# EAGLE design bbaudio (EAGLE 6.4)
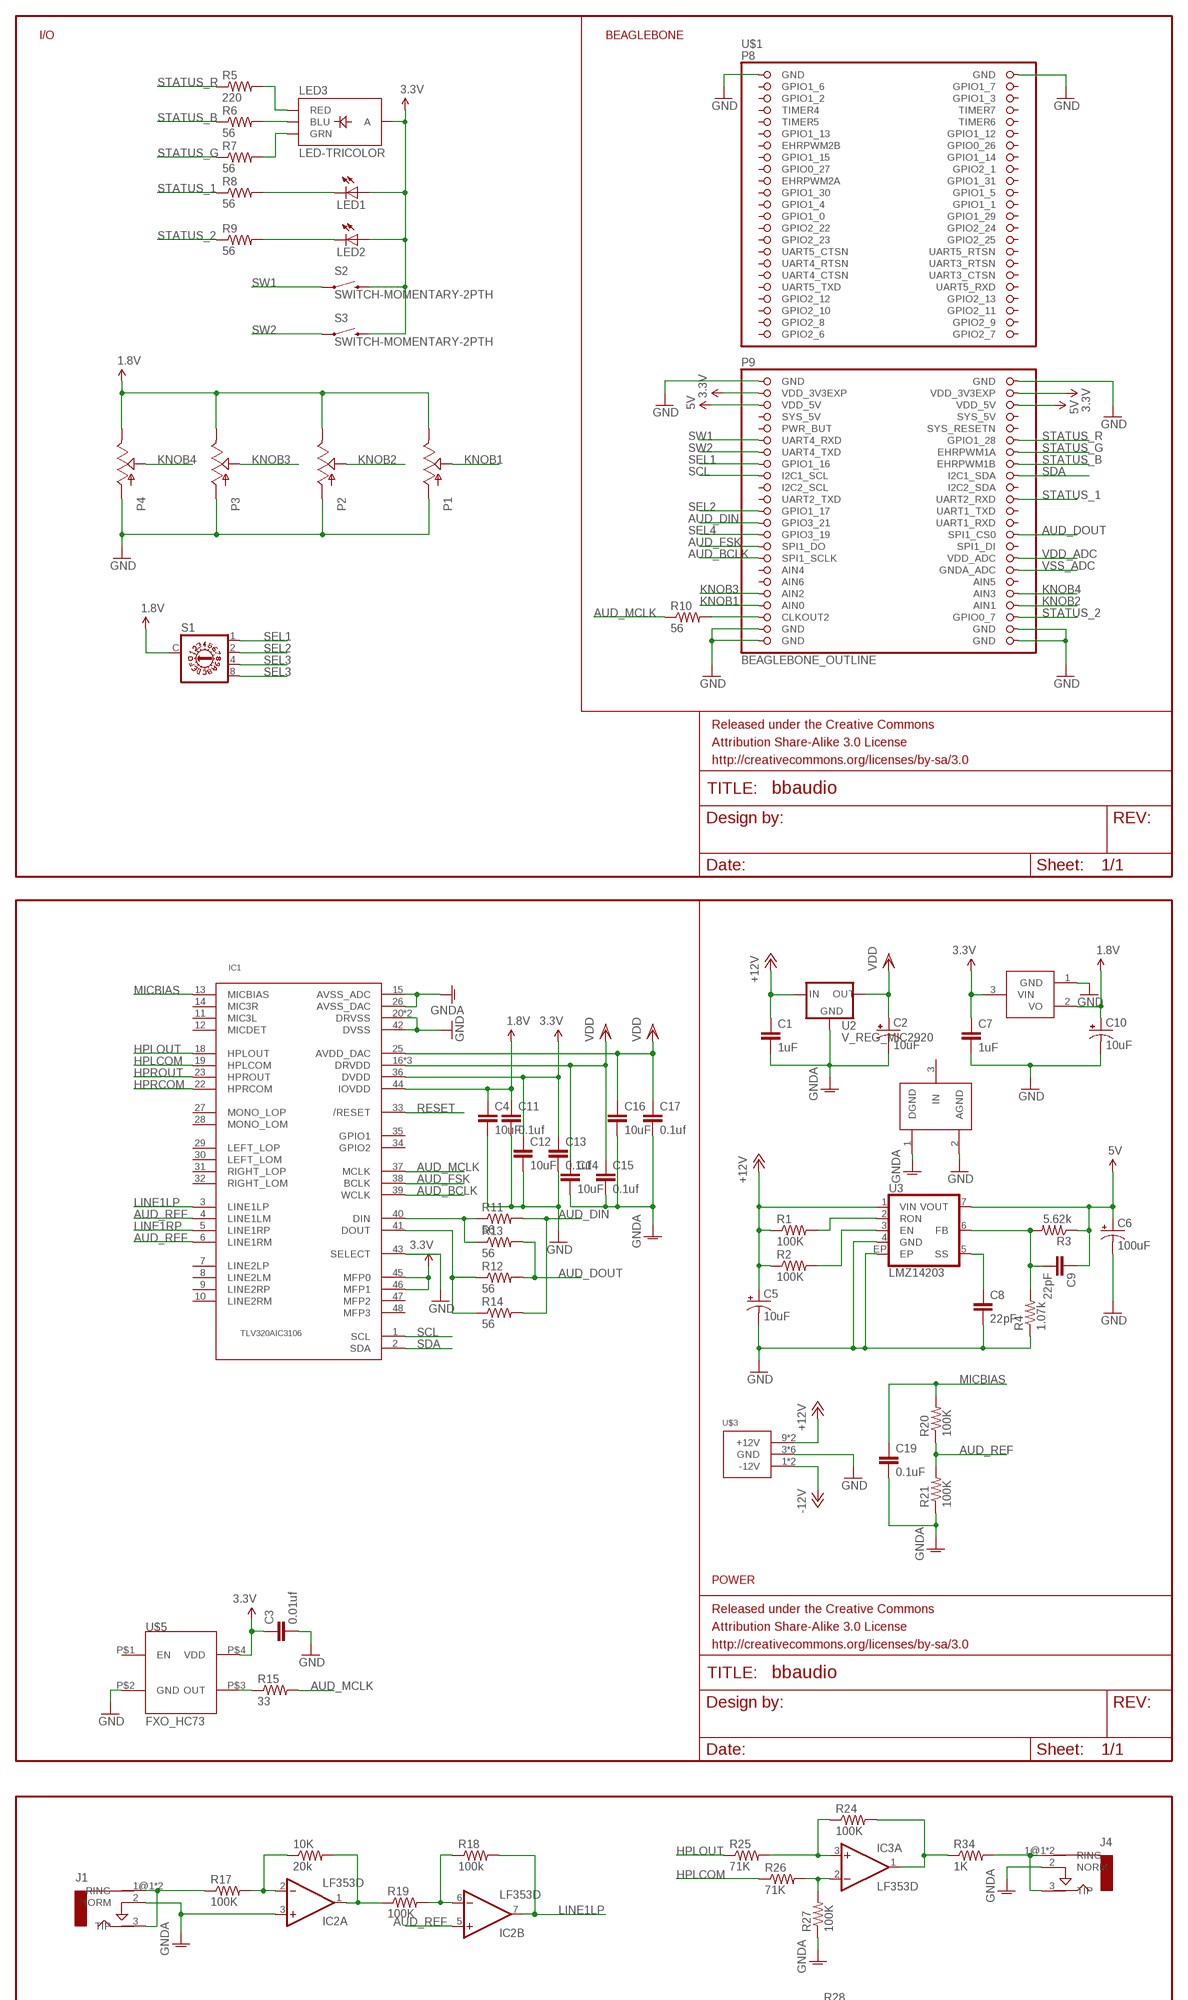
[diagram p0: schematic, sheet 1, part 1 of 2]
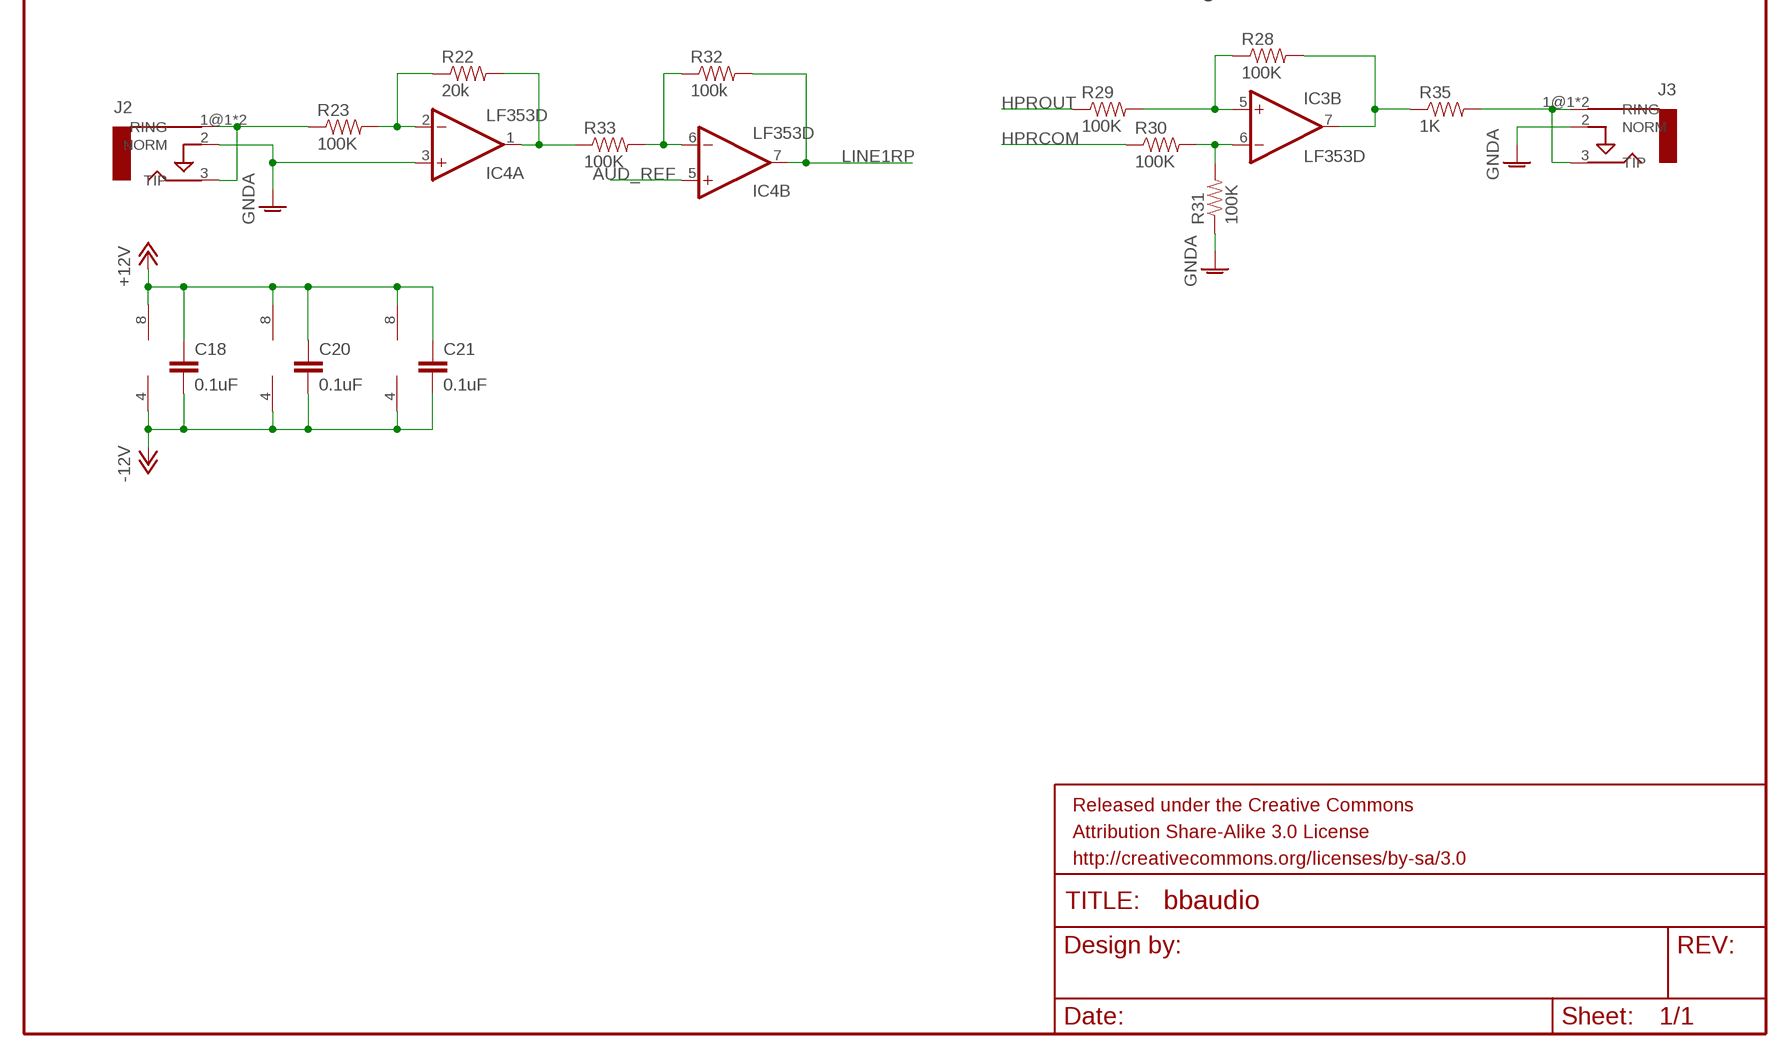
[diagram p1: schematic, sheet 1, part 2 of 2]

## Parts
10K  20k  RESISTOR0603-RES  [0603-RES]
C1  1uF  C-EUC0603  [C0603]
C2  10uF  CAP_POL1206  [EIA3216]
C3  0.01uf  C-EUC0603  [C0603]
C4  10uF  C-EUC0603  [C0603]
C5  10uF  CAP_POL1206  [EIA3216]
C6  100uF  CAP_POL1206  [EIA3216]
C7  1uF  C-EUC0603  [C0603]
C8  22pF  C-EUC0603  [C0603]
C9  22pF  C-EUC0603  [C0603]
C10  10uF  CAP_POL1206  [EIA3216]
C11  0.1uf  C-EUC0603  [C0603]
C12  10uF  C-EUC0603  [C0603]
C13  0.1uf  C-EUC0603  [C0603]
C14  10uF  C-EUC0603  [C0603]
C15  0.1uf  C-EUC0603  [C0603]
C16  10uF  C-EUC0603  [C0603]
C17  0.1uf  C-EUC0603  [C0603]
C18  0.1uF  C-EUC0603  [C0603]
C19  0.1uF  C-EUC0603  [C0603]
C20  0.1uF  C-EUC0603  [C0603]
C21  0.1uF  C-EUC0603  [C0603]
IC1  TLV320AIC3106  [QFN48]
IC2  LF353D  [SO08]
IC3  LF353D  [SO08]
IC4  LF353D  [SO08]
J1  AUDIO-JACKERTHENVAR  [ERTHENVAR-JACK]
J2  AUDIO-JACKERTHENVAR  [ERTHENVAR-JACK]
J3  AUDIO-JACKERTHENVAR  [ERTHENVAR-JACK]
J4  AUDIO-JACKERTHENVAR  [ERTHENVAR-JACK]
LED1  LED-FKIT-1206  [FKIT-LED-1206]
LED2  LED-FKIT-1206  [FKIT-LED-1206]
LED3  LED-TRICOLOR  [LED-TRICOLOR-SMD]
P1  SPARKFUN_POTPDB12  [SPARKFUN_PDB12]
P2  SPARKFUN_POTPDB12  [SPARKFUN_PDB12]
P3  SPARKFUN_POTPDB12  [SPARKFUN_PDB12]
P4  SPARKFUN_POTPDB12  [SPARKFUN_PDB12]
R1  100K  RESISTOR0603-RES  [0603-RES]
R2  100K  RESISTOR0603-RES  [0603-RES]
R3  5.62k  RESISTOR0603-RES  [0603-RES]
R4  1.07k  RESISTOR0603-RES  [0603-RES]
R5  220  RESISTOR0603-RES  [0603-RES]
R6  56  RESISTOR0603-RES  [0603-RES]
R7  56  RESISTOR0603-RES  [0603-RES]
R8  56  RESISTOR0603-RES  [0603-RES]
R9  56  RESISTOR0603-RES  [0603-RES]
R10  56  RESISTOR0603-RES  [0603-RES]
R11  56  RESISTOR0603-RES  [0603-RES]
R12  56  RESISTOR0603-RES  [0603-RES]
R13  56  RESISTOR0603-RES  [0603-RES]
R14  56  RESISTOR0603-RES  [0603-RES]
R15  33  RESISTOR0603-RES  [0603-RES]
R17  100K  RESISTOR0603-RES  [0603-RES]
R18  100k  RESISTOR0603-RES  [0603-RES]
R19  100K  RESISTOR0603-RES  [0603-RES]
R20  100K  RESISTOR0603-RES  [0603-RES]
R21  100K  RESISTOR0603-RES  [0603-RES]
R22  20k  RESISTOR0603-RES  [0603-RES]
R23  100K  RESISTOR0603-RES  [0603-RES]
R24  100K  RESISTOR0603-RES  [0603-RES]
R25  71K  RESISTOR0603-RES  [0603-RES]
R26  71K  RESISTOR0603-RES  [0603-RES]
R27  100K  RESISTOR0603-RES  [0603-RES]
R28  100K  RESISTOR0603-RES  [0603-RES]
R29  100K  RESISTOR0603-RES  [0603-RES]
R30  100K  RESISTOR0603-RES  [0603-RES]
R31  100K  RESISTOR0603-RES  [0603-RES]
R32  100k  RESISTOR0603-RES  [0603-RES]
R33  100K  RESISTOR0603-RES  [0603-RES]
R34  1K  RESISTOR0603-RES  [0603-RES]
R35  1K  RESISTOR0603-RES  [0603-RES]
S1  P103  [P103]
S2  SWITCH-MOMENTARY-2PTH  [TACTILE-PTH]
S3  SWITCH-MOMENTARY-2PTH  [TACTILE-PTH]
U2  V_REG_MIC2920  [SOT223]
U3  LMZ14203  [TO-PMOD-7]
U4  VREG  [SOT23-3]
U$1  BEAGLEBONE_OUTLINE  [BEAGLEBONE_SHIELD]
U$3  POWER_SIMPLE10  [POWER_10]
U$5  FXO_HC73  [4PIN]
U$11  GND_CONNECT  [GND_CONNECT]

## Nets
1.8V: C4.1 C10.A(+) C11.1 IC1.44(IOVDD) P1.3(E) P2.3(E) P3.3(E) P4.3(E) S1.C U4.2(VO)
3.3V: C3.1 C7.1 C12.1 C13.1 IC1.36(DVDD) IC1.45(MFP0) IC1.46(MFP1) LED1.A LED2.A LED3.A S2.3 S3.3 U4.3(VIN) U$1.49(VDD_3V3EXP) U$1.50(VDD_3V3EXP) U$5.P$4(VDD)
5V: C6.A(+) C9.1 R3.1 U3.7(VOUT) U$1.51(VDD_5V) U$1.52(VDD_5V)
+12V: C1.1 C5.A(+) C18.1 C20.1 C21.1 IC2.8(P:V+) IC3.8(P:V+) IC4.8(P:V+) R1.1 R2.1 U2.1(IN) U3.1(VIN) U$3.9(+12V) U$3.10(+12V)
-12V: C18.2 C20.2 C21.2 IC2.4(P:V-) IC3.4(P:V-) IC4.4(P:V-) U$3.1(-12V) U$3.2(-12V)
AUD_BCLK: IC1.39(WCLK) U$1.77(SPI1_SCLK)
AUD_DIN: R11.2 R14.2 U$1.71(GPIO3_21)
AUD_DOUT: R12.2 R13.2 U$1.74(SPI1_CS0)
AUD_FSK: IC1.38(BCLK) U$1.75(SPI1_DO)
AUD_MCLK: IC1.37(MCLK) R10.1 R15.2
AUD_REF: IC1.4(LINE1LM) IC1.6(LINE1RM) IC2.5(B:+IN) IC4.5(B:+IN) R20.1 R21.2
GND: C3.2 C4.2 C5.C(-) C6.C(-) C7.2 C8.2 C10.C(-) C11.2 C12.2 C13.2 IC1.20(DRVSS) IC1.21(DRVSS) IC1.42(DVSS) IC1.43(SELECT) P1.1(A) P2.1(A) P3.1(A) P4.1(A) R4.1 U3.4(GND) U3.EP U4.1(GND) U$1.1(GND) U$1.2(GND) U$1.47(GND) U$1.48(GND) U$1.89(GND) U$1.90(GND) U$1.91(GND) U$1.92(GND) U$3.3(GND) U$3.4(GND) U$3.5(GND) U$3.6(GND) U$3.7(GND) U$3.8(GND) U$5.P$2(GND) U$11.2(AGND)
GNDA: C1.2 C2.C(-) C14.2 C15.2 C16.2 C17.2 C19.2 IC1.15(AVSS_ADC) IC1.26(AVSS_DAC) IC2.3(A:+IN) IC4.3(A:+IN) J1.2(NORM) J2.2(NORM) J3.2(NORM) J4.2(NORM) R21.1 R27.1 R31.1 U2.2(GND) U$11.1(DGND)
HPLCOM: IC1.19(HPLCOM) R26.1
HPLOUT: IC1.18(HPLOUT) R25.1
HPRCOM: IC1.22(HPRCOM) R30.1
HPROUT: IC1.23(HPROUT) R29.1
KNOB1: P1.2(S) U$1.85(AIN0)
KNOB2: P2.2(S) U$1.86(AIN1)
KNOB3: P3.2(S) U$1.83(AIN2)
KNOB4: P4.2(S) U$1.84(AIN3)
LINE1LP: IC1.3(LINE1LP) IC2.7(B:OUT) R18.2
LINE1RP: IC1.5(LINE1RP) IC4.7(B:OUT) R32.2
MICBIAS: C19.1 IC1.13(MICBIAS) R20.2
N$1: LED3.R(RED) R5.2
N$2: LED3.B(BLU) R6.2
N$3: LED3.G(GRN) R7.2
N$4: LED1.C R8.2
N$5: LED2.C R9.2
N$6: R1.2 U3.2(RON)
N$7: R2.2 U3.3(EN)
N$8: C8.1 U3.5(SS)
N$9: R10.2 U$1.87(CLKOUT2)
N$10: IC1.40(DIN) R11.1 R13.1
N$11: IC1.41(DOUT) R12.1 R14.1
N$12: R15.1 U$5.P$3(OUT)
N$13: C9.2 R3.2 R4.2 U3.6(FB)
N$14: 10K.2 IC2.1(A:OUT) R19.1
N$15: IC2.6(B:-IN) R18.1 R19.2
N$17: 10K.1 IC2.2(A:-IN) R17.2
N$18: J1.1@1(RING) J1.1@2(RING) J1.3(TIP) R17.1
N$19: J2.1@1(RING) J2.1@2(RING) J2.3(TIP) R23.1
N$20: J4.1@1(RING) J4.1@2(RING) J4.3(TIP) R34.2
N$21: IC4.2(A:-IN) R22.1 R23.2
N$22: IC4.1(A:OUT) R22.2 R33.1
N$23: IC4.6(B:-IN) R32.1 R33.2
N$27: IC3.1(A:OUT) R24.2 R34.1
N$28: IC3.3(A:+IN) R24.1 R25.2
N$29: IC3.2(A:-IN) R26.2 R27.2
N$31: IC3.7(B:OUT) R28.2 R35.1
N$32: IC3.5(B:+IN) R28.1 R29.2
N$33: IC3.6(B:-IN) R30.2 R31.2
N$34: J3.1@1(RING) J3.1@2(RING) J3.3(TIP) R35.2
RESET: IC1.33(/RESET)
SCL: IC1.1(SCL) U$1.63(I2C1_SCL)
SDA: IC1.2(SDA) U$1.64(I2C1_SDA)
SEL1: S1.1 U$1.61(GPIO1_16)
SEL2: S1.2 U$1.69(GPIO1_17)
SEL3: S1.4
SEL4: S1.8 U$1.73(GPIO3_19)
STATUS_1: R8.1 U$1.68(UART2_RXD)
STATUS_2: R9.1 U$1.88(GPIO0_7)
STATUS_B: R6.1 U$1.62(EHRPWM1B)
STATUS_G: R7.1 U$1.60(EHRPWM1A)
STATUS_R: R5.1 U$1.58(GPIO1_28)
SW1: S2.1 U$1.57(UART4_RXD)
SW2: S3.1 U$1.59(UART4_TXD)
VDD: C2.A(+) C14.1 C15.1 C16.1 C17.1 IC1.16(DRVDD) IC1.17(DRVDD) IC1.24(DRVDD) IC1.25(AVDD_DAC) U2.3(OUT)
VDD_ADC: U$1.78(VDD_ADC)
VSS_ADC: U$1.80(GNDA_ADC)
Unconnected: IC1.7(LINE2LP) IC1.8(LINE2LM) IC1.9(LINE2RP) IC1.10(LINE2RM) IC1.11(MIC3L) IC1.12(MICDET) IC1.14(MIC3R) IC1.27(MONO_LOP) IC1.28(MONO_LOM) IC1.29(LEFT_LOP) IC1.30(LEFT_LOM) IC1.31(RIGHT_LOP) IC1.32(RIGHT_LOM) IC1.34(GPIO2) IC1.35(GPIO1) IC1.47(MFP2) IC1.48(MFP3) U$1.3(GPIO1_6) U$1.4(GPIO1_7) U$1.5(GPIO1_2) U$1.6(GPIO1_3) U$1.7(TIMER4) U$1.8(TIMER7) U$1.9(TIMER5) U$1.10(TIMER6) U$1.11(GPIO1_13) U$1.12(GPIO1_12) U$1.13(EHRPWM2B) U$1.14(GPIO0_26) U$1.15(GPIO1_15) U$1.16(GPIO1_14) U$1.17(GPIO0_27) U$1.18(GPIO2_1) U$1.19(EHRPWM2A) U$1.20(GPIO1_31) U$1.21(GPIO1_30) U$1.22(GPIO1_5) U$1.23(GPIO1_4) U$1.24(GPIO1_1) U$1.25(GPIO1_0) U$1.26(GPIO1_29) U$1.27(GPIO2_22) U$1.28(GPIO2_24) U$1.29(GPIO2_23) U$1.30(GPIO2_25) U$1.31(UART5_CTSN) U$1.32(UART5_RTSN) U$1.33(UART4_RTSN) U$1.34(UART3_RTSN) U$1.35(UART4_CTSN) U$1.36(UART3_CTSN) U$1.37(UART5_TXD) U$1.38(UART5_RXD) U$1.39(GPIO2_12) U$1.40(GPIO2_13) U$1.41(GPIO2_10) U$1.42(GPIO2_11) U$1.43(GPIO2_8) U$1.44(GPIO2_9) U$1.45(GPIO2_6) U$1.46(GPIO2_7) U$1.54(SYS_5V) U$1.55(PWR_BUT) U$1.56(SYS_RESETN) U$1.65(I2C2_SCL) U$1.66(I2C2_SDA) U$1.67(UART2_TXD) U$1.70(UART1_TXD) U$1.72(UART1_RXD) U$1.76(SPI1_DI) U$1.79(AIN4) U$1.81(AIN6) U$1.82(AIN5) U$5.P$1(EN) U$11.3(IN)

## Notes on the sheet
- I/O | BEAGLEBONE
- POWER

## Power pins joined to a net without a drawn wire
SYS_5V: U$1.53(SYS_5V)

## Library data of the parts
10K R1-R15 R17-R35 = SparkFun-Passives:RESISTOR: Resistor Basic schematic elements and footprints for 0603, 1206, and PTH resistors.
C1 C3 C4 C7-C9 C11-C21 = rcl:C-EU: CAPACITOR, European symbol
C2 C5 C6 C10 = sparkfun:CAP_POL: Capacitor Polarized These are standard SMD and PTH capacitors. Normally 10uF, 47uF, and 100uF in electrolytic and tantalum varieties. Always verify the external diameter of the through hole cap, it varies with capacity, voltage, and manufacturer. The EIA devices should be standard.
IC1 = codec:TLV320AIC3106
IC2-IC4 = linear:LF353: OP AMP
J1-J4 = erthenvar:AUDIO-JACK: Switching Mono 3.5mm Audio Jack from Erthenvar.
LED1 LED2 = sparkfun:LED: LEDs Standard schematic elements and footprints for 5mm, 3mm, 1206, and 0603 sized LEDs. 5mm - Spark Fun Electronics SKU : COM-00529 (and others)
LED3 = SparkFun-LED:LED-TRICOLOR: Tri-Color LED SMD Proven layout and schematic for triple color LED in SMD package - common anode. Spark Fun Electronics SKU : COM-07844
P1-P4 = DCO_PIGGY:SPARKFUN_POT
S1 = switch-dil:P103: DIL/CODE SWITCH; OC_FARNELL: unknown; OC_NEWARK: unknown
S2 S3 = sparkfun:SWITCH-MOMENTARY-2
U2 = sparkfun:V_REG_MIC2920: MIC2920A (http://www.micrel.com/_PDF/mic2920.pdf) - 400mA output LDO Regulator
U3 = SparkFun-PowerIC:LMZ14203: 3A, Simple Switcher Power Module with 42V Maximum Input
U4 = nonolith:VREG
U$1 = custom:BEAGLEBONE_OUTLINE: Should match A3 pinout - but not completely tested
U$3 = eurorack:POWER_SIMPLE
U$5 = codec:FXO_HC73
U$11 = sparkfun:GND_CONNECT

## Board
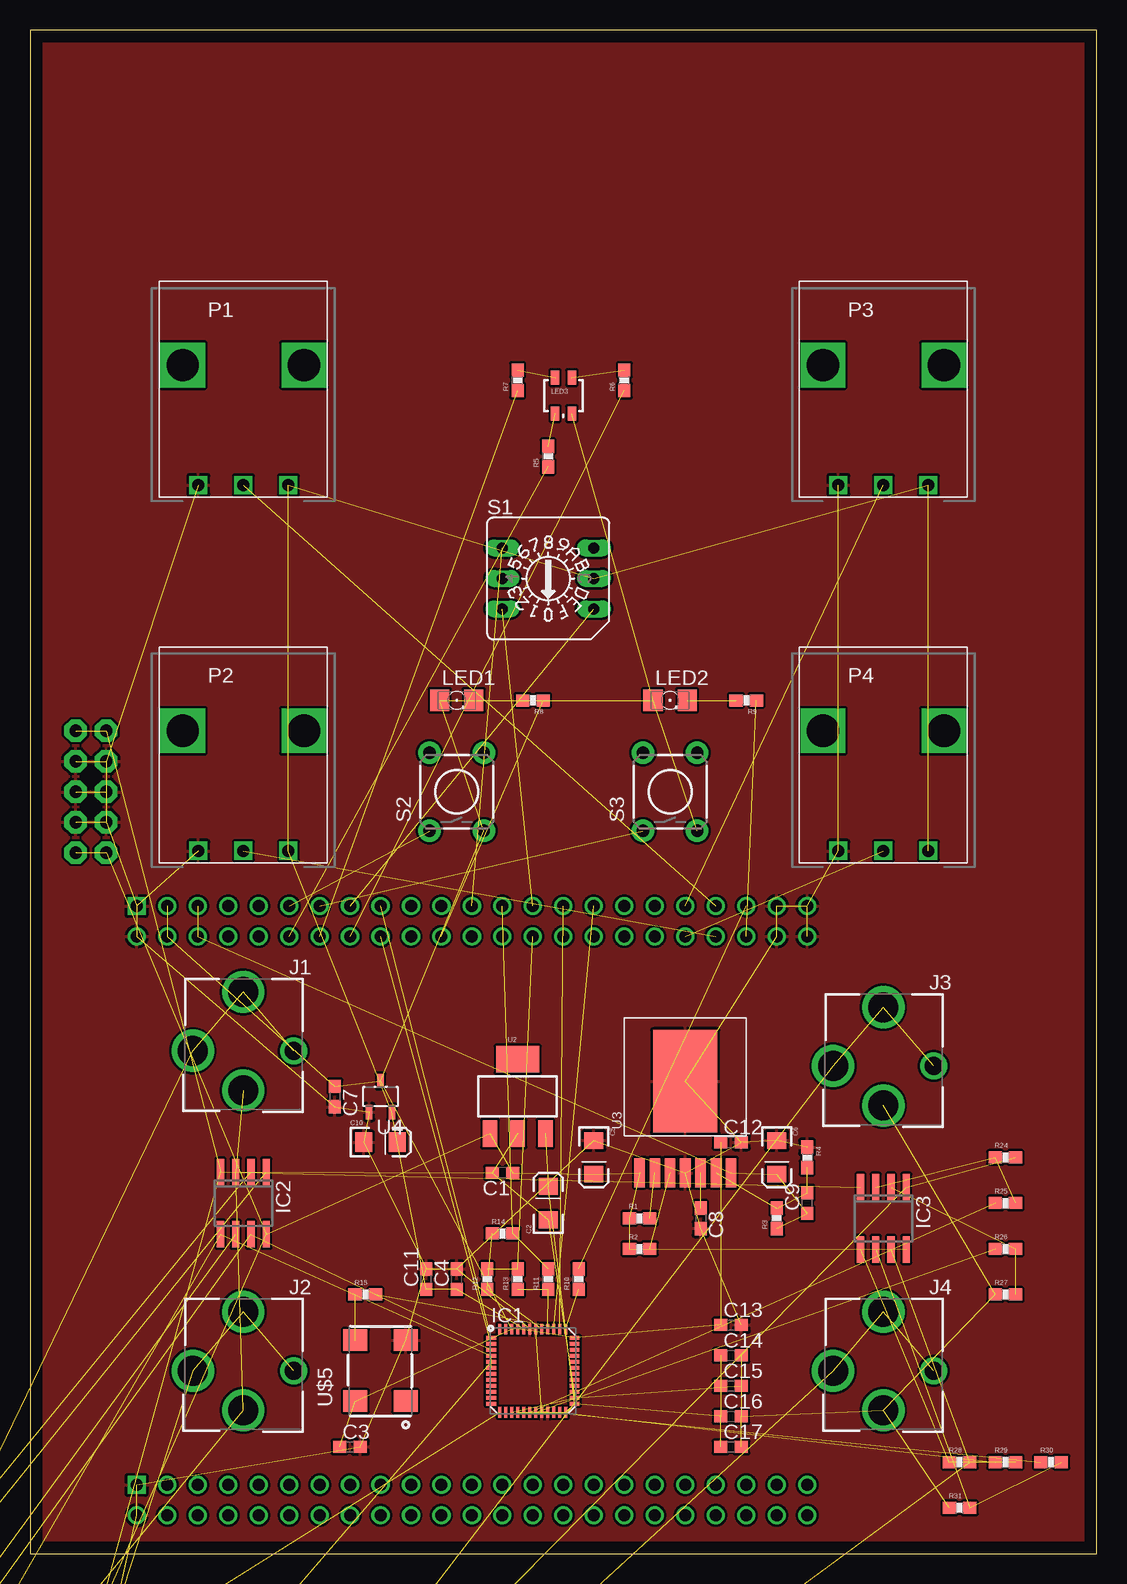
[diagram p2: board, top side]
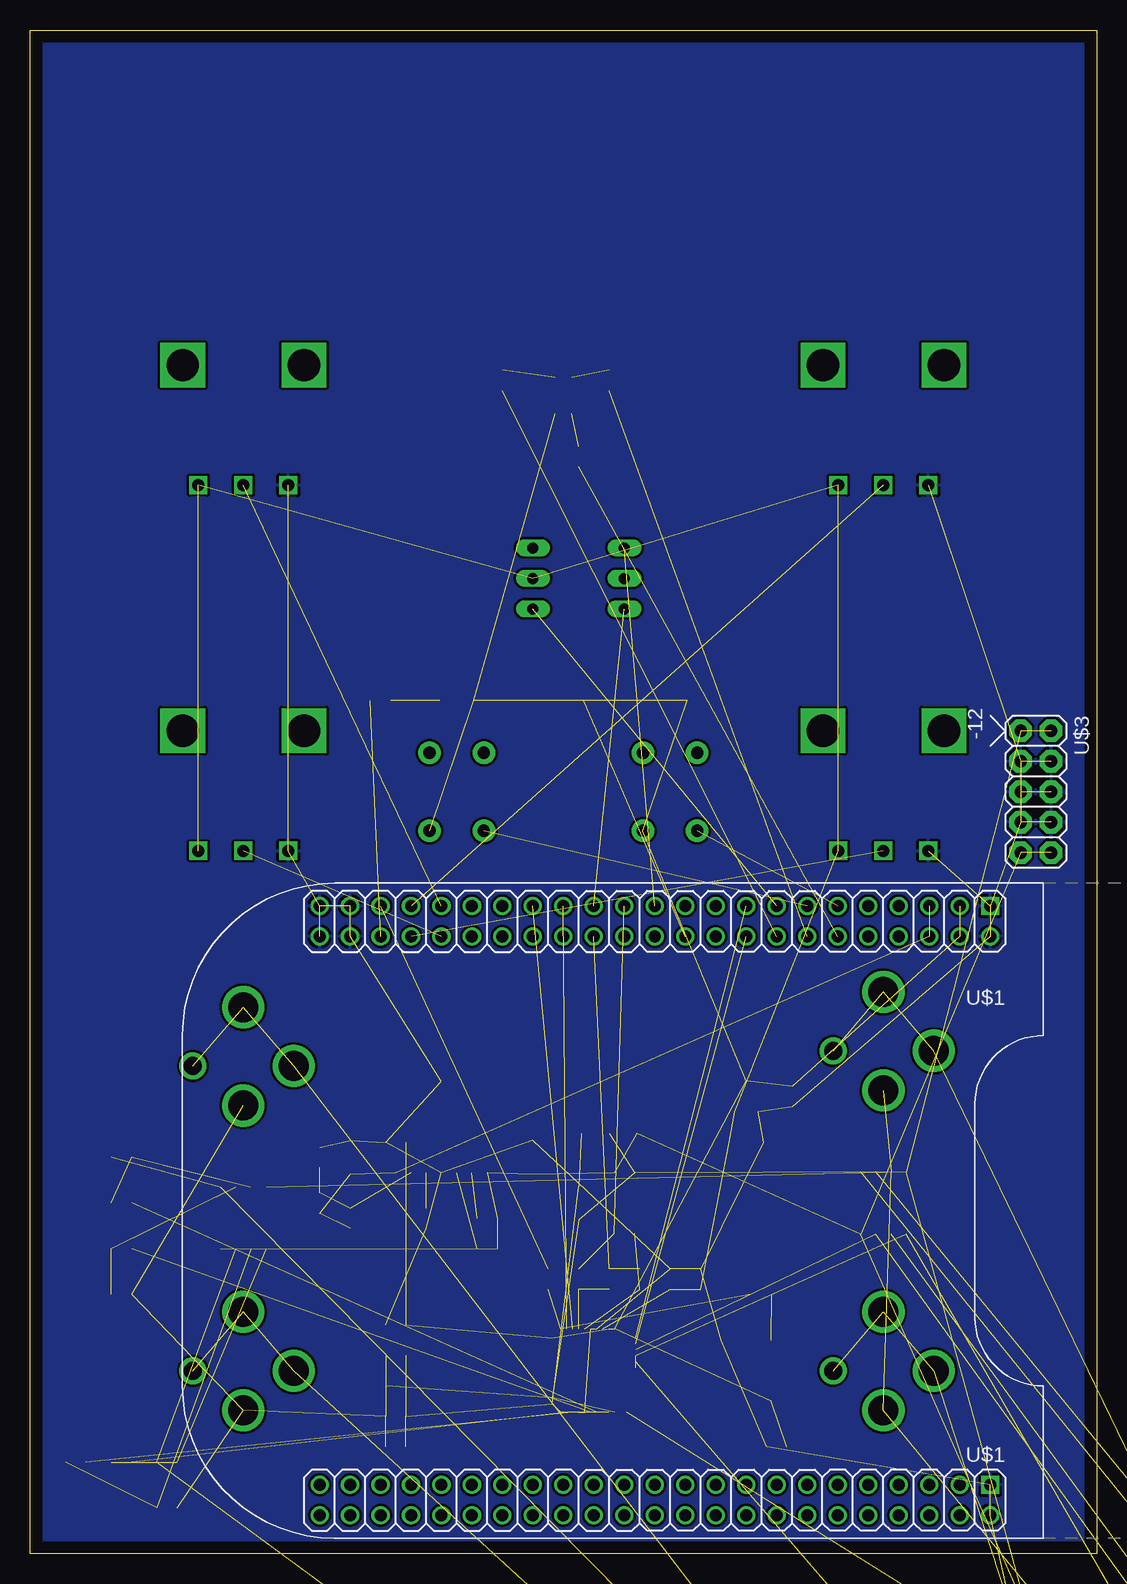
[diagram p3: board, bottom side, seen from below]

Size 88.9 x 127 mm. Coordinates in mm from the lower left corner, seen from the top.
Outline: 0,0 88.9,0 88.9,127 0,127 0,0
Copper layers (1*16): Top 0.035mm / dielectric 1.5mm / Bottom 0.035mm
Design rules "default": minimum track width 10mil, minimum drill 24mil, track to track 8mil, track to pad 8mil, pad to pad 8mil, via to via 8mil, smd to smd 8mil, copper to edge 40mil, drill to drill 8mil, minimum pad ring 10mil, minimum via ring 8mil, stop-mask expansion 4mil, vias tented up to drill 0mil, thermal gap 10mil

### Footprints (pad centres in the part's own frame; a part is rotated, then mirrored left to right if it is on the bottom)
0603-RES = smd 1.1 x 1: 1 -0.85,0; 2 0.85,0
C0603 = smd 1.1 x 1: 1 -0.85,0; 2 0.85,0
EIA3216 = smd 1.4 x 1.6: A 1.4,0; C -1.4,0
QFN48 = smd 0.85 x 0.28: 1 -3.475,2.75; 2 -3.475,2.25; 3 -3.475,1.75; 4 -3.475,1.25; 5 -3.475,0.75; 6 -3.475,0.25; 7 -3.475,-0.25; 8 -3.475,-0.75; 9 -3.475,-1.25; 10 -3.475,-1.75; 11 -3.475,-2.25; 12 -3.475,-2.75; 25 3.475,-2.75; 26 3.475,-2.25; 27 3.475,-1.75; 28 3.475,-1.25; 29 3.475,-0.75; 30 3.475,-0.25; 31 3.475,0.25; 32 3.475,0.75; 33 3.475,1.25; 34 3.475,1.75; 35 3.475,2.25; 36 3.475,2.75 | smd 0.28 x 0.85: 13 -2.75,-3.475; 14 -2.25,-3.475; 15 -1.75,-3.475; 16 -1.25,-3.475; 17 -0.75,-3.475; 18 -0.25,-3.475; 19 0.25,-3.475; 20 0.75,-3.475; 21 1.25,-3.475; 22 1.75,-3.475; 23 2.25,-3.475; 24 2.75,-3.475; 37 2.75,3.475; 38 2.25,3.475; 39 1.75,3.475; 40 1.25,3.475; 41 0.75,3.475; 42 0.25,3.475; 43 -0.25,3.475; 44 -0.75,3.475; 45 -1.25,3.475; 46 -1.75,3.475; 47 -2.25,3.475; 48 -2.75,3.475
SO08 = smd 0.6 x 2.2: 1 -1.905,-2.6; 2 -0.635,-2.6; 3 0.635,-2.6; 4 1.905,-2.6; 5 1.905,2.6; 6 0.635,2.6; 7 -0.635,2.6; 8 -1.905,2.6
ERTHENVAR-JACK = drill 2.5: 1@1 -4.2,0; 2 0,-3.3; 3 0,4.9 | drill 1.5: 1@2 4.2,0
FKIT-LED-1206 = smd 1.6 x 1.803: A -1.422,0; C 1.422,0
LED-TRICOLOR-SMD = smd 0.7 x 1.2: A 0.7,-1.5; B 0.7,1.5; G -0.7,1.5; R -0.7,-1.5
SPARKFUN_PDB12 = drill 1 square: 1 -3.75,-10; 2 0,-10; 3 3.75,-10 | drill 2.7 square: P$4 5.05,0; P$5 -5.05,0
P103 = drill 0.914 long: 1 3.81,-2.54; 2 -3.81,2.54; 4 3.81,2.54; 8 -3.81,-2.54; C 3.81,0; C1 -3.81,0
TACTILE-PTH = drill 1.016 pad 1.88: 1 -3.251,2.261; 2 3.251,2.261; 3 -3.251,-2.261; 4 3.251,-2.261
SOT223 = smd 1.219 x 2.235: 1 -2.311,-3.099; 2 0,-3.099; 3 2.311,-3.099 | smd 3.6 x 2.2: 4 0,3.099
TO-PMOD-7 = smd 0.89 x 2.41: 1 -3.81,-7.63; 2 -2.54,-7.63; 3 -1.27,-7.63; 4 0,-7.63; 5 1.27,-7.63; 6 2.57,-7.63; 7 3.81,-7.63 | smd 5.35 x 8.54: EP 0,0
SOT23-3 = smd 0.55 x 1.2: 1 0.95,1.3; 2 -0.95,1.3; 3 0,-1.3
BEAGLEBONE_SHIELD = drill 1 square: 1 4.445,19.05; 47 52.705,19.05 | drill 1: 2 1.905,19.05; 3 4.445,21.59; 4 1.905,21.59; 5 4.445,24.13; 6 1.905,24.13; 7 4.445,26.67; 8 1.905,26.67; 9 4.445,29.21; 10 1.905,29.21; 11 4.445,31.75; 12 1.905,31.75; 13 4.445,34.29; 14 1.905,34.29; 15 4.445,36.83; 16 1.905,36.83; 17 4.445,39.37; 18 1.905,39.37; 19 4.445,41.91; 20 1.905,41.91; 21 4.445,44.45; 22 1.905,44.45; 23 4.445,46.99; 24 1.905,46.99; 25 4.445,49.53; 26 1.905,49.53; 27 4.445,52.07; 28 1.905,52.07; 29 4.445,54.61; 30 1.905,54.61; 31 4.445,57.15; 32 1.905,57.15; 33 4.445,59.69; 34 1.905,59.69; 35 4.445,62.23; 36 1.905,62.23; 37 4.445,64.77; 38 1.905,64.77; 39 4.445,67.31; 40 1.905,67.31; 41 4.445,69.85; 42 1.905,69.85; 43 4.445,72.39; 44 1.905,72.39; 45 4.445,74.93; 46 1.905,74.93; 48 50.165,19.05; 49 52.705,21.59; 50 50.165,21.59; 51 52.705,24.13; 52 50.165,24.13; 53 52.705,26.67; 54 50.165,26.67; 55 52.705,29.21; 56 50.165,29.21; 57 52.705,31.75; 58 50.165,31.75; 59 52.705,34.29; 60 50.165,34.29; 61 52.705,36.83; 62 50.165,36.83; 63 52.705,39.37; 64 50.165,39.37; 65 52.705,41.91; 66 50.165,41.91; 67 52.705,44.45; 68 50.165,44.45; 69 52.705,46.99; 70 50.165,46.99; 71 52.705,49.53; 72 50.165,49.53; 73 52.705,52.07; 74 50.165,52.07; 75 52.705,54.61; 76 50.165,54.61; 77 52.705,57.15; 78 50.165,57.15; 79 52.705,59.69; 80 50.165,59.69; 81 52.705,62.23; 82 50.165,62.23; 83 52.705,64.77; 84 50.165,64.77; 85 52.705,67.31; 86 50.165,67.31; 87 52.705,69.85; 88 50.165,69.85; 89 52.705,72.39; 90 50.165,72.39; 91 52.705,74.93; 92 50.165,74.93
POWER_10 = drill 1.016 pad 1.88 octagon: 1 -5.08,-1.27; 2 -5.08,1.27; 3 -2.54,-1.27; 4 -2.54,1.27; 5 0,-1.27; 6 0,1.27; 7 2.54,-1.27; 8 2.54,1.27; 9 5.08,-1.27; 10 5.08,1.27
4PIN = smd 1.8 x 2: P$1 -2.54,-2.1; P$2 2.54,-2.1; P$3 2.54,2.1; P$4 -2.54,2.1
GND_CONNECT = smd 1.016 x 1.016: 1 -1.016,0; 2 -1.016,-1.27; 3 0.254,-0.635

### Placement (x,y rotation side)
10K  -8.89,-2.54 0 top  (outside the outline)
C1  39.37,31.75 180 top
C2  43.18,29.21 90 top
C3  26.67,8.89 0 top
C4  35.56,22.86 90 top
C5  46.99,33.02 270 top
C6  62.23,33.02 270 top
C7  25.4,38.1 270 top
C8  55.88,27.94 270 top
C9  64.77,29.21 90 top
C10  29.21,34.29 0 top
C11  33.02,22.86 90 top
C12  58.42,34.29 0 top
C13  58.42,19.05 0 top
C14  58.42,16.51 0 top
C15  58.42,13.97 0 top
C16  58.42,11.43 0 top
C17  58.42,8.89 0 top
C18  -8.89,-62.23 0 top  (outside the outline)
C19  -8.89,-31.75 0 top  (outside the outline)
C20  -8.89,-67.31 0 top  (outside the outline)
C21  -8.89,-72.39 0 top  (outside the outline)
IC1  41.91,15.24 0 top
IC2  17.78,29.21 180 top
IC3  71.12,27.94 180 top
IC4  -6.35,-39.37 0 top  (outside the outline)
J1  17.78,41.91 0 top
J2  17.78,15.24 0 top
J3  71.12,40.64 0 top
J4  71.12,15.24 0 top
LED1  35.56,71.12 0 top
LED2  53.34,71.12 0 top
LED3  44.45,96.52 0 top
P1  17.78,99.06 0 top
P2  17.78,68.58 0 top
P3  71.12,99.06 0 top
P4  71.12,68.58 0 top
R1  50.8,27.94 0 top
R2  50.8,25.4 0 top
R3  62.23,27.94 90 top
R4  64.77,33.02 270 top
R5  43.18,91.44 90 top
R6  49.53,97.79 90 top
R7  40.64,97.79 90 top
R8  41.91,71.12 180 top
R9  59.69,71.12 180 top
R10  45.72,22.86 90 top
R11  43.18,22.86 90 top
R12  38.1,22.86 90 top
R13  40.64,22.86 90 top
R14  39.37,26.67 0 top
R15  27.94,21.59 0 top
R17  -8.89,-6.35 0 top  (outside the outline)
R18  -8.89,-10.16 0 top  (outside the outline)
R19  -8.89,-13.97 0 top  (outside the outline)
R20  -8.89,-17.78 0 top  (outside the outline)
R21  -8.89,-21.59 0 top  (outside the outline)
R22  -8.89,-45.72 0 top  (outside the outline)
R23  -5.08,-45.72 0 top  (outside the outline)
R24  81.28,33.02 0 top
R25  81.28,29.21 0 top
R26  81.28,25.4 0 top
R27  81.28,21.59 0 top
R28  77.47,7.62 0 top
R29  81.28,7.62 0 top
R30  85.09,7.62 0 top
R31  77.47,3.81 0 top
R32  -1.27,-45.72 0 top  (outside the outline)
R33  -8.89,-49.53 0 top  (outside the outline)
R34  -8.89,-53.34 0 top  (outside the outline)
R35  -8.89,-57.15 0 top  (outside the outline)
S1  43.18,81.28 0 top
S2  35.56,63.5 90 top
S3  53.34,63.5 90 top
U2  40.64,38.1 0 top
U3  54.61,39.37 0 top
U4  29.21,38.1 180 top
U$1  -10.16,1.27 90 bottom
U$3  5.08,63.5 270 bottom
U$5  29.21,15.24 90 top
U$11  -8.89,-78.74 0 top  (outside the outline)

### Tracks (layer width: path | path; a pad name or v marks a point on that pad's centre or on a via)
1.8V  (9 unrouted)
3.3V  (15 unrouted)
5V  (5 unrouted)
+12V  (13 unrouted)
-12V  (7 unrouted)
AUD_BCLK  (1 unrouted)
AUD_DIN  (2 unrouted)
AUD_DOUT  (2 unrouted)
AUD_FSK  (1 unrouted)
AUD_MCLK  (2 unrouted)
AUD_REF  (5 unrouted)
GND  (37 unrouted)
  pour Bottom: 0,127 0,0 88.9,0 88.9,127
  pour Top: 0,127 0,0 88.9,0 88.9,127
GNDA  (19 unrouted)
HPLCOM  (1 unrouted)
HPLOUT  (1 unrouted)
HPRCOM  (1 unrouted)
HPROUT  (1 unrouted)
KNOB1  (1 unrouted)
KNOB2  (1 unrouted)
KNOB3  (1 unrouted)
KNOB4  (1 unrouted)
LINE1LP  (2 unrouted)
LINE1RP  (2 unrouted)
MICBIAS  (2 unrouted)
N$1  (1 unrouted)
N$2  (1 unrouted)
N$3  (1 unrouted)
N$4  (1 unrouted)
N$5  (1 unrouted)
N$6  (1 unrouted)
N$7  (1 unrouted)
N$8  (1 unrouted)
N$9  (1 unrouted)
N$10  (2 unrouted)
N$11  (2 unrouted)
N$12  (1 unrouted)
N$13  (3 unrouted)
N$14  (2 unrouted)
N$15  (2 unrouted)
N$17  (2 unrouted)
N$18  (3 unrouted)
N$19  (3 unrouted)
N$20  (3 unrouted)
N$21  (2 unrouted)
N$22  (2 unrouted)
N$23  (2 unrouted)
N$27  (2 unrouted)
N$28  (2 unrouted)
N$29  (2 unrouted)
N$31  (2 unrouted)
N$32  (2 unrouted)
N$33  (2 unrouted)
N$34  (3 unrouted)
SCL  (1 unrouted)
SDA  (1 unrouted)
SEL1  (1 unrouted)
SEL2  (1 unrouted)
SEL4  (1 unrouted)
STATUS_1  (1 unrouted)
STATUS_2  (1 unrouted)
STATUS_B  (1 unrouted)
STATUS_G  (1 unrouted)
STATUS_R  (1 unrouted)
SW1  (1 unrouted)
SW2  (1 unrouted)
VDD  (9 unrouted)